# EAGLE design T03_Schematic (EAGLE 7.1.0)
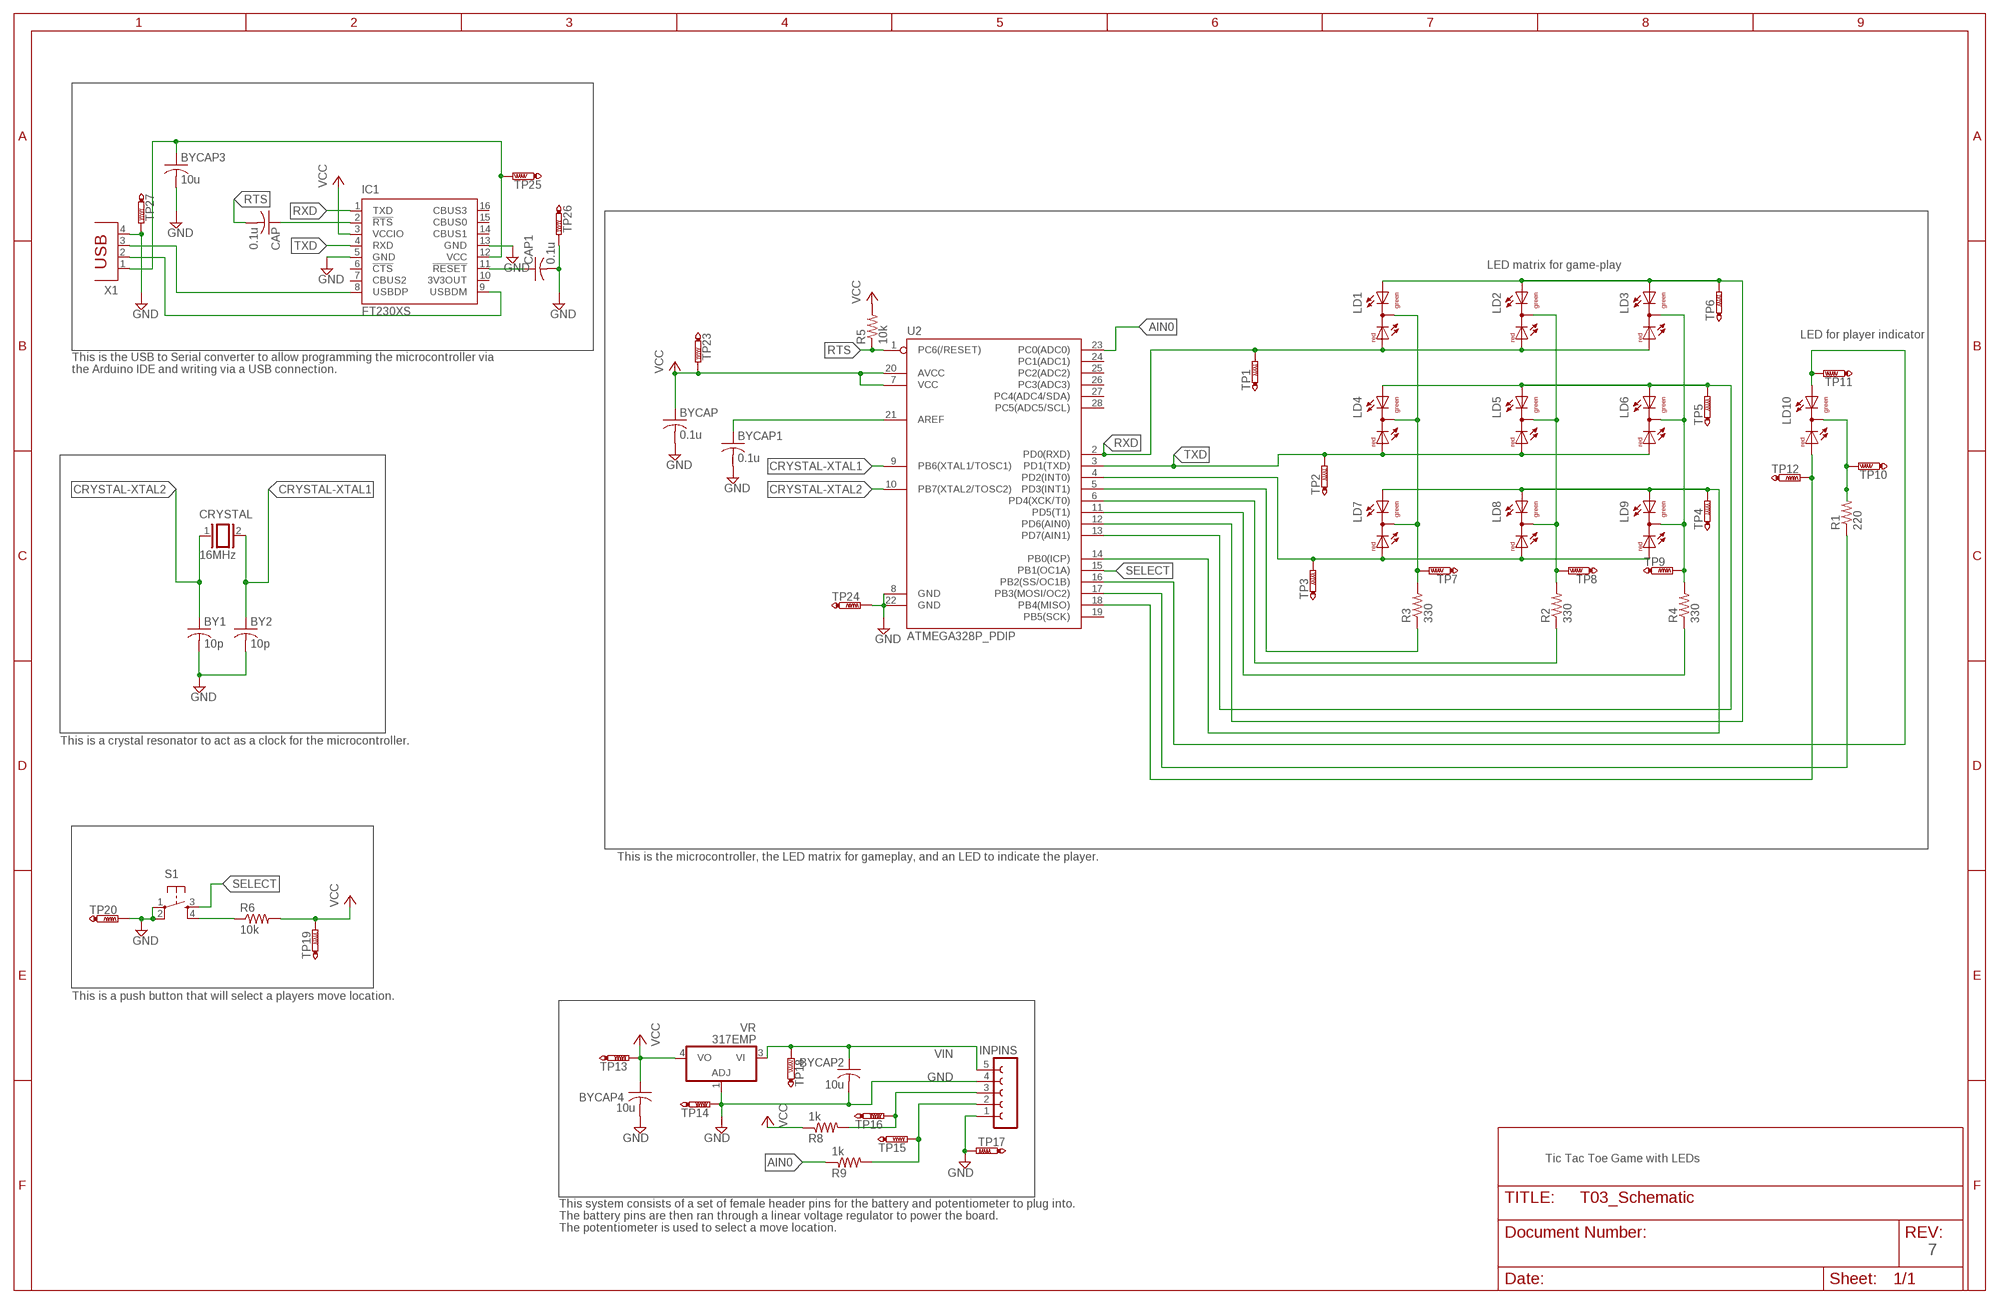
[diagram p0: schematic, sheet 1]

## Parts
BY1  10p  C-USC0805  [C0805]
BY2  10p  C-USC0805  [C0805]
BYCAP  0.1u  C-USC0805  [C0805]
BYCAP1  0.1u  C-USC0805  [C0805]
BYCAP2  10u  C-USC0805  [C0805]
BYCAP3  10u  C-USC0805  [C0805]
BYCAP4  10u  C-USC0805  [C0805]
CAP  0.1u  C-USC0805  [C0805]
CAP1  0.1u  C-USC0805  [C0805]
CRYSTAL  16MHz  XTAL/S  [QS]
IC1  FT230XS  [SSOP16]
INPINS  FE05-1  [FE05-1]
LD1  DUOLED-RG-C  [DUOLED-C-5MM]
LD2  DUOLED-RG-C  [DUOLED-C-5MM]
LD3  DUOLED-RG-C  [DUOLED-C-5MM]
LD4  DUOLED-RG-C  [DUOLED-C-5MM]
LD5  DUOLED-RG-C  [DUOLED-C-5MM]
LD6  DUOLED-RG-C  [DUOLED-C-5MM]
LD7  DUOLED-RG-C  [DUOLED-C-5MM]
LD8  DUOLED-RG-C  [DUOLED-C-5MM]
LD9  DUOLED-RG-C  [DUOLED-C-5MM]
LD10  DUOLED-RG-C  [DUOLED-C-5MM]
R1  220  R-US_M0805  [M0805]
R2  330  R-US_M0805  [M0805]
R3  330  R-US_M0805  [M0805]
R4  330  R-US_M0805  [M0805]
R5  10k  R-US_M0805  [M0805]
R6  10k  R-US_M0805  [M0805]
R8  1k  R-US_M0805  [M0805]
R9  1k  R-US_M0805  [M0805]
S1  DTS-6  [DTS-6]
TP1  PTR1B1,27  [B1,27]
TP2  PTR1B1,27  [B1,27]
TP3  PTR1B1,27  [B1,27]
TP4  PTR1B1,27  [B1,27]
TP5  PTR1B1,27  [B1,27]
TP6  PTR1B1,27  [B1,27]
TP7  PTR1B1,27  [B1,27]
TP8  PTR1B1,27  [B1,27]
TP9  PTR1B1,27  [B1,27]
TP10  PTR1B1,27  [B1,27]
TP11  PTR1B1,27  [B1,27]
TP12  PTR1B1,27  [B1,27]
TP13  PTR1B1,27  [B1,27]
TP14  PTR1B1,27  [B1,27]
TP15  PTR1B1,27  [B1,27]
TP16  PTR1B1,27  [B1,27]
TP17  PTR1B1,27  [B1,27]
TP18  PTR1B1,27  [B1,27]
TP19  PTR1B1,27  [B1,27]
TP20  PTR1B1,27  [B1,27]
TP23  PTR1B1,27  [B1,27]
TP24  PTR1B1,27  [B1,27]
TP25  PTR1B1,27  [B1,27]
TP26  PTR1B1,27  [B1,27]
TP27  PTR1B1,27  [B1,27]
U2  ATMEGA328P_PDIP  [DIL28-3]
VR  317EMP  [SOT223]
X1  PN61729  [PN61729]

## Nets
AIN0: R9.1 U2.23(PC0(ADC0))
CATH1: R3.1 U2.5(PD3(INT1))
CATH2: R2.1 U2.6(PD4(XCK/T0))
CATH3: R4.1 U2.11(PD5(T1))
CATH4: R1.1 U2.17(PB3(MOSI/OC2))
CRYSTAL-XTAL1: BY2.1 CRYSTAL.2 U2.9(PB6(XTAL1/TOSC1))
CRYSTAL-XTAL2: BY1.1 CRYSTAL.1 U2.10(PB7(XTAL2/TOSC2))
D+: IC1.8(USBDP) X1.3
D-: IC1.9(USBDM) X1.2
GND [power]: BY1.2 BY2.2 BYCAP1.2 BYCAP2.2 BYCAP3.2 BYCAP4.2 BYCAP.2 CAP1.2 IC1.5(GND) IC1.13(GND) INPINS.1 INPINS.4 S1.1 S1.2 TP14.TP TP17.TP TP20.TP TP24.TP TP26.TP TP27.TP U2.8(GND) U2.22(GND) VR.1(ADJ) X1.4
GREN1: LD1.AX(AG) LD2.AX(AG) LD3.AX(AG) TP6.TP U2.12(PD6(AIN0))
GREN2: LD4.AX(AG) LD5.AX(AG) LD6.AX(AG) TP5.TP U2.13(PD7(AIN1))
GREN3: LD7.AX(AG) LD8.AX(AG) LD9.AX(AG) TP4.TP U2.14(PB0(ICP))
N$1: LD1.C LD4.C LD7.C R3.2 TP7.TP
N$2: R6.1 S1.4
N$3: LD2.C LD5.C LD8.C R2.2 TP8.TP
N$4: CAP.1 IC1.2(!RTS)
N$6: LD3.C LD6.C LD9.C R4.2 TP9.TP
N$8: CAP1.1 IC1.11(!RESET)
N$9: BYCAP1.1 U2.21(AREF)
N$10: LD10.C R1.2 TP10.TP
PLAY1: LD10.AX(AG) TP11.TP U2.16(PB2(SS/OC1B))
PLAY2: LD10.AR TP12.TP U2.18(PB4(MISO))
RED3: LD7.AR LD8.AR LD9.AR TP3.TP U2.4(PD2(INT0))
RTS: CAP.2 R5.1 U2.1(PC6(/RESET))
RXD: IC1.1(TXD) LD1.AR LD2.AR LD3.AR TP1.TP U2.2(PD0(RXD))
SELECT: S1.3 U2.15(PB1(OC1A))
SELECTPIN: INPINS.2 R9.2 TP15.TP
TXD: IC1.4(RXD) LD4.AR LD5.AR LD6.AR TP2.TP U2.3(PD1(TXD))
USBVCC [usb]: BYCAP3.1 IC1.12(VCC) TP25.TP X1.1
V+POT: INPINS.3 R8.2 TP16.TP
VCC [power]: BYCAP4.1 BYCAP.1 IC1.3(VCCIO) R5.2 R6.2 R8.1 TP13.TP TP19.TP TP23.TP U2.7(VCC) U2.20(AVCC) VR.4(VO)
VIN [power]: BYCAP2.1 INPINS.5 TP18.TP VR.3(VI)
Unconnected: IC1.6(!CTS) IC1.7(CBUS2) IC1.10(3V3OUT) IC1.14(CBUS1) IC1.15(CBUS0) IC1.16(CBUS3) U2.19(PB5(SCK)) U2.24(PC1(ADC1)) U2.25(PC2(ADC2)) U2.26(PC3(ADC3)) U2.27(PC4(ADC4/SDA)) U2.28(PC5(ADC5/SCL))

## Notes on the sheet
- LED matrix for game-play
- LED for player indicator
- This is the USB to Serial converter to allow programming the microcontroller via 
  the Arduino IDE and writing via a USB connection.
- This is a crystal resonator to act as a clock for the microcontroller.
- This is the microcontroller, the LED matrix for gameplay, and an LED to indicate the player.
- This is a push button that will select a players move location.
- Tic Tac Toe Game with LEDs
- This system consists of a set of female header pins for the battery and potentiometer to plug into.
  The battery pins are then ran through a linear voltage regulator to power the board.
  The potentiometer is used to select a move location.
- 7

## Library data of the parts
BY1 BY2 BYCAP BYCAP1-BYCAP4 CAP CAP1 = adafruit:C-US: CAPACITOR, American symbol
CRYSTAL = special:XTAL/S: CRYSTAL
IC1 = ftdichip:FT230X: USB to BASIC UART IC Auto generated by make-symbol-device-package-bsdl.ulp Rev. 43 Source: Data sheet <http://www.ftdichip.com/Support/Documents/DataSheets/ICs/DS_FT230X.pdf>
INPINS = con-lsta:FE05-1: FEMALE HEADER; OC_FARNELL: unknown; OC_NEWARK: unknown
LD1-LD10 = led:DUOLED-RG-C: DUO LED 2 colors (red/green), 5 mm, round, common Cathode www.ligitek.com or other producers.
R1-R6 R8 R9 = adafruit:R-US_: RESISTOR, American symbol
S1 = switch-tact:DTS-6
TP1-TP20 TP23-TP27 = testpad:PTR1: TEST PIN
U2 = SparkFun-DigitalIC:ATMEGA328P_PDIP: uC used in the Arduino 32kb flash, 1k EEPROM, 2k SRAM This is the through-hole version of this chip.
VR = linear:*317: Positive VOLTAGE REGULATOR
X1 = con-berg:PN61729: BERG USB connector; OC_FARNELL: unknown; OC_NEWARK: unknown

## Net classes
0 default: width 0.203 mm
1 power: width 1.27 mm
2 usb: width 0.635 mm

## Board
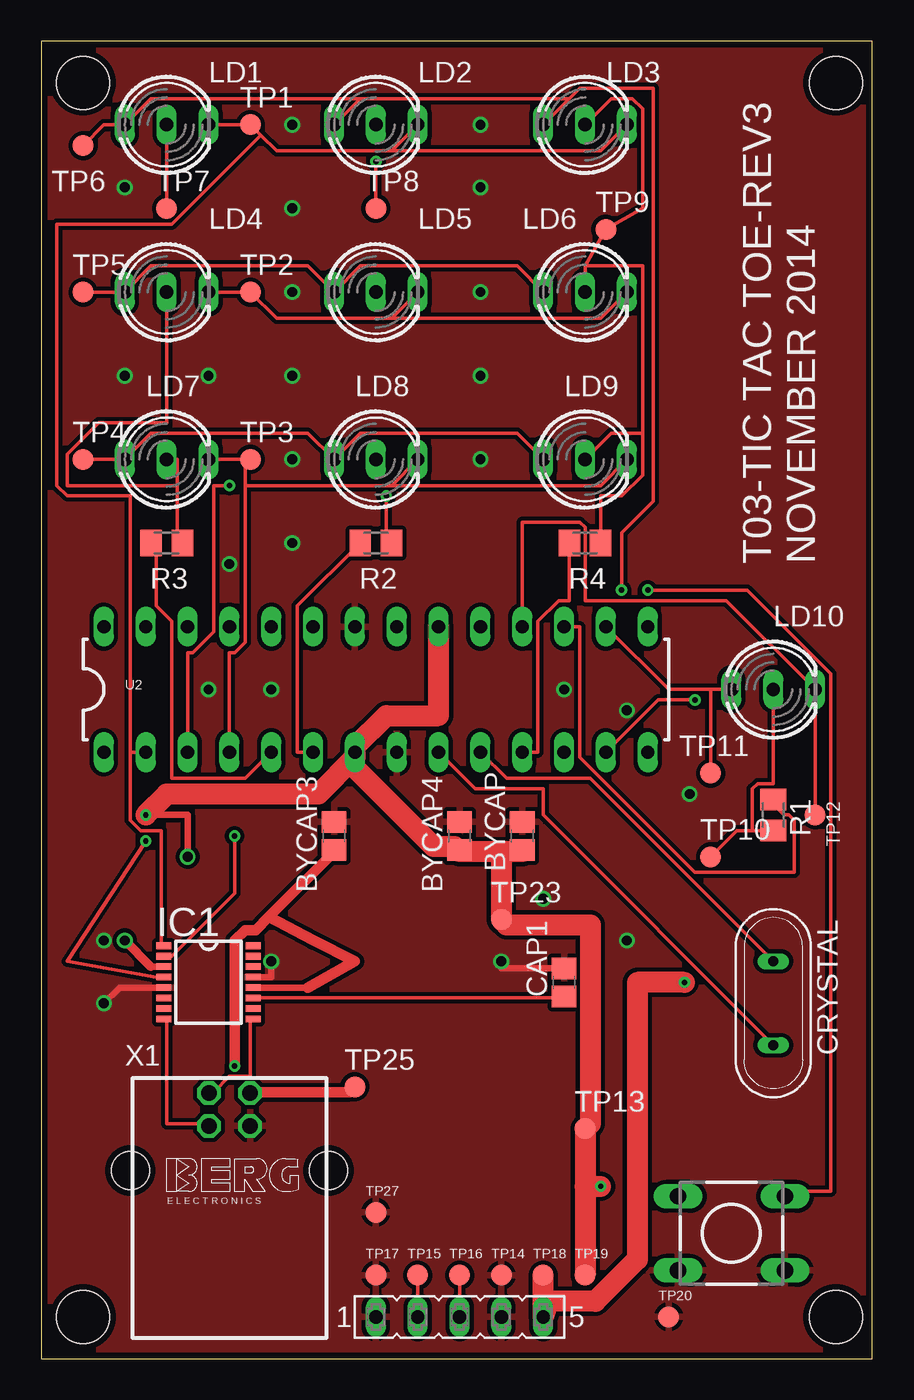
[diagram p1: board, top side]
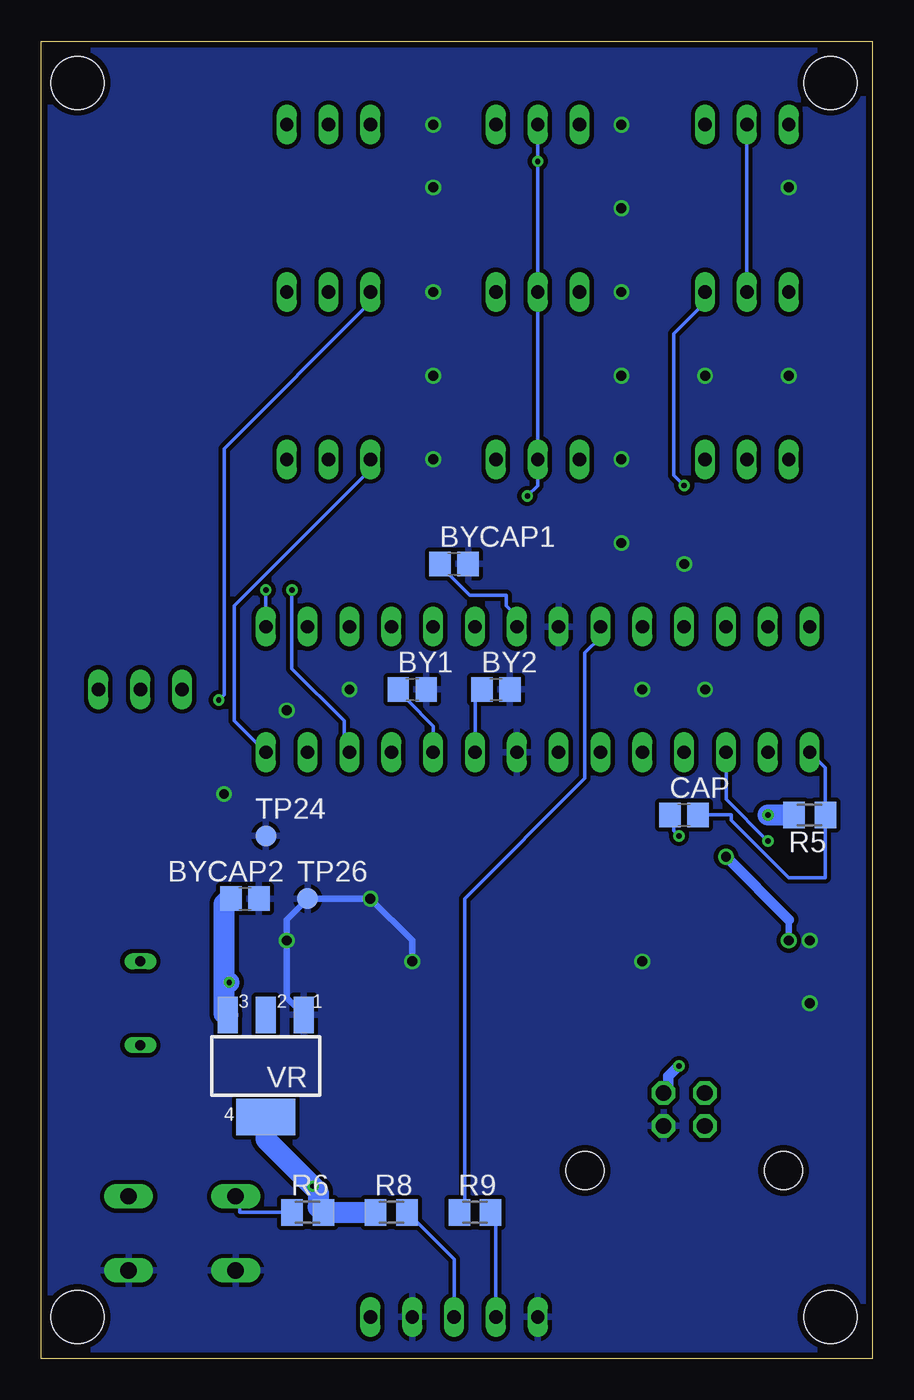
[diagram p2: board, bottom side, seen from below]

Size 50.47 x 80 mm. Coordinates in mm from the lower left corner, seen from the top.
Outline: 0,0 50.47,0 50.47,80 0,80 0,0
Copper layers (1*16): Top 0.0356mm / dielectric 1.5011mm / Bottom 0.0356mm
Design rules "OSH-Park-2-layer": minimum track width 6mil, minimum drill 13mil, track to track 6mil, track to pad 6mil, pad to pad 6mil, via to via 6mil, smd to smd 6mil, copper to edge 15mil, drill to drill 6mil, minimum pad ring 7mil, minimum via ring 7mil, stop-mask expansion 3mil, vias tented up to drill 0mil, thermal gap 10mil
Holes 3.2 mm at 2.54,2.54 48.26,2.54 48.26,77.47 2.54,77.47

### Footprints (pad centres in the part's own frame; a part is rotated, then mirrored left to right if it is on the bottom)
C0805 = smd 1.3 x 1.5: 1 -0.85,0; 2 0.85,0
QS = drill 0.61 long: 1 -2.54,0; 2 2.54,0
SSOP16 = smd 0.914 x 0.406: 1 -2.718,2.223; 2 -2.718,1.587; 3 -2.718,0.953; 4 -2.718,0.318; 5 -2.718,-0.318; 6 -2.718,-0.953; 7 -2.718,-1.587; 8 -2.718,-2.223; 9 2.718,-2.223; 10 2.718,-1.587; 11 2.718,-0.953; 12 2.718,-0.318; 13 2.718,0.318; 14 2.718,0.953; 15 2.718,1.587; 16 2.718,2.223
FE05-1 = drill 0.813 long: 1 -5.08,0; 2 -2.54,0; 3 0,0; 4 2.54,0; 5 5.08,0
DUOLED-C-5MM = drill 0.813 long: AR 2.54,0; AX -2.54,0; C 0,0
M0805 = smd 1.3 x 1.6: 1 -0.95,0; 2 0.95,0
DTS-6 = drill 1 long: 1 -3.25,2.25; 2 3.25,2.25; 3 -3.25,-2.25; 4 3.25,-2.25
B1,27 = smd 1.27 x 1.27: TP 0,0
DIL28-3 = drill 0.813 long: 1 -16.51,-3.81; 2 -13.97,-3.81; 3 -11.43,-3.81; 4 -8.89,-3.81; 5 -6.35,-3.81; 6 -3.81,-3.81; 7 -1.27,-3.81; 8 1.27,-3.81; 9 3.81,-3.81; 10 6.35,-3.81; 11 8.89,-3.81; 12 11.43,-3.81; 13 13.97,-3.81; 14 16.51,-3.81; 15 16.51,3.81; 16 13.97,3.81; 17 11.43,3.81; 18 8.89,3.81; 19 6.35,3.81; 20 3.81,3.81; 21 1.27,3.81; 22 -1.27,3.81; 23 -3.81,3.81; 24 -6.35,3.81; 25 -8.89,3.81; 26 -11.43,3.81; 27 -13.97,3.81; 28 -16.51,3.81
SOT223 = smd 1.219 x 2.235: 1 -2.311,-3.099; 2 0,-3.099; 3 2.311,-3.099 | smd 3.6 x 2.2: 4 0,3.099
PN61729 = drill 0.95 octagon: 1 1.25,4.71; 2 -1.25,4.71; 3 -1.25,2.71; 4 1.25,2.71 | hole 2.3: -6.02,0; 6.02,0

### Placement (x,y rotation side)
BY1  27.94,40.64 0 bottom
BY2  22.86,40.64 0 bottom
BYCAP  29.21,31.75 90 top
BYCAP1  25.4,48.26 0 bottom
BYCAP2  38.1,27.94 0 bottom
BYCAP3  17.78,31.75 90 top
BYCAP4  25.4,31.75 90 top
CAP  11.43,33.02 0 bottom
CAP1  31.75,22.86 90 top
CRYSTAL  44.45,21.59 270 top
IC1  10.16,22.86 0 top
INPINS  25.4,2.54 0 top
LD1  7.62,74.93 0 top
LD2  20.32,74.93 0 top
LD3  33.02,74.93 0 top
LD4  7.62,64.77 0 top
LD5  20.32,64.77 0 top
LD6  33.02,64.77 0 top
LD7  7.62,54.61 0 top
LD8  20.32,54.61 0 top
LD9  33.02,54.61 0 top
LD10  44.45,40.64 0 top
R1  44.45,33.02 270 top
R2  20.32,49.53 0 top
R3  7.62,49.53 0 top
R4  33.02,49.53 0 top
R5  3.81,33.02 180 bottom
R6  34.29,8.89 0 bottom
R8  29.21,8.89 0 bottom
R9  24.13,8.89 0 bottom
S1  41.91,7.62 180 top
TP1  12.7,74.93 0 top
TP2  12.7,64.77 0 top
TP3  12.7,54.61 0 top
TP4  2.54,54.61 0 top
TP5  2.54,64.77 0 top
TP6  2.54,73.66 0 top
TP7  7.62,69.85 0 top
TP8  20.32,69.85 0 top
TP9  34.29,68.58 0 top
TP10  40.64,30.48 0 top
TP11  40.64,35.56 0 top
TP12  46.99,33.02 0 top
TP13  33.02,13.97 0 top
TP14  27.94,5.08 0 top
TP15  22.86,5.08 0 top
TP16  25.4,5.08 0 top
TP17  20.32,5.08 0 top
TP18  30.48,5.08 0 top
TP19  33.02,5.08 0 top
TP20  38.1,2.54 0 top
TP23  27.94,26.67 0 top
TP24  36.83,31.75 0 bottom
TP25  19.05,16.51 0 top
TP26  34.29,27.94 0 bottom
TP27  20.32,8.89 0 top
U2  20.32,40.64 0 top
VR  36.83,17.78 180 bottom
X1  11.43,11.43 0 top

### Tracks (layer width: path | path; a pad name or v marks a point on that pad's centre or on a via)
AIN0
  Bottom 0.203: U2.23 16.51,43.81 17.46,42.86 17.46,35.24 24.77,27.94 24.77,8.89 R9.1
CATH1
  Top 0.203: U2.5 12.38,35.24 7.94,35.24 7.94,44.77 6.99,45.72 6.99,49.53 R3.1
CATH2
  Top 0.203: U2.6 15.56,36.83 15.56,45.72 R2.1
CATH3
  Top 0.203: U2.11 30.16,36.83 30.16,44.77 31.43,46.04 32.07,46.04 R4.1
CATH4
  Top 0.203: U2.17 32.7,44.45 32.7,36.51 39.69,29.53 45.72,29.53 45.72,32.7 45.4,33.02 45.09,33.02 44.45,33.66 R1.1
CRYSTAL-XTAL1
  Top 0.203: CRYSTAL.2 30.48,33.02 30.48,34.61 26.35,34.61 U2.9
  Bottom 0.203: U2.9 24.13,40.32 23.81,40.64 BY2.1
CRYSTAL-XTAL2
  Top 0.203: CRYSTAL.1 33.34,35.24 28.26,35.24 U2.10
  Bottom 0.203: U2.10 26.67,38.42 28.26,40.01 28.26,40.32 28.57,40.64 BY1.1
D+
  Top 0.203: IC1.8 7.62,20.64 7.62,14.29 10.16,14.29 X1.3
D-
  Top 0.203: IC1.9 12.7,20.64 12.7,17.14 11.43,17.14 10.48,16.19 X1.2
GND  (via drill 0.6)
  Top 0.406: IC1.5 4.76,22.54 v3.81,21.59 | IC1.13 13.97,23.18 v13.97,24.13 | CAP1.2 27.94,23.71 v27.94,24.13
  Bottom 0.406: v27.94,24.13 27.94,25.4 v30.48,27.94 TP26.TP 35.56,26.67 v35.56,25.4 35.56,24.13 35.56,21.92 VR.1
  other vias: 3.81,25.4 39.37,34.29 31.75,40.64 35.56,39.37 13.97,40.64 15.24,49.53 15.24,59.69 26.67,59.69 26.67,54.61 5.08,59.69 10.16,59.69 15.24,69.85 5.08,71.12 26.67,71.12 26.67,64.77 15.24,64.77 26.67,74.93 15.24,74.93 10.16,40.64 11.43,48.26 15.24,54.61
  pour Bottom (isolate 0.254): -1.27,81.28 -1.27,-2.54 53.34,-2.54 53.34,81.28
  pour Top (isolate 0.254): -1.27,81.28 -1.27,-2.54 53.34,-2.54 53.34,81.28
GREN1  (via drill 0.33)
  Top 0.203: TP6.TP 3.81,74.93 LD1.AX 6.67,76.52 19.37,76.52 | v35.24,46.67 35.24,50.16 37.15,52.07 37.15,77.15 32.7,77.15 32.07,76.52 | LD3.AX 32.07,76.52 | 19.37,76.52 LD2.AX | 32.07,76.52 19.37,76.52
  Bottom 0.203: U2.12 32.07,37.15 32.07,38.73 35.24,41.91 v35.24,46.67
GREN2  (via drill 0.33)
  Top 0.203: TP5.TP LD4.AX 6.67,66.36 16.19,66.36 LD5.AX 19.37,66.36 28.89,66.36 LD6.AX | U2.13 37.47,40.01 v39.69,40.01
  Bottom 0.203: v39.69,40.01 39.37,40.32 39.37,55.24 30.48,64.14 LD6.AX
GREN3
  Top 0.203: TP4.TP LD7.AX 6.67,56.2 16.19,56.2 LD8.AX 19.37,56.2 28.89,56.2 LD9.AX
  Bottom 0.203: U2.14 38.73,38.73 38.73,45.72 30.48,53.98 LD9.AX
N$1
  Top 0.203: LD1.C TP7.TP | 8.26,53.02 8.26,54.61 LD7.C | 8.26,53.02 8.26,49.53 R3.2 | LD4.C 7.62,56.83 3.49,56.83 1.59,54.93 1.59,53.02 8.26,53.02
  Bottom 0.203: LD4.C LD1.C
N$2
  Bottom 0.203: R6.1 38.42,8.89 38.42,9.84 S1.4
N$3  (via drill 0.33)
  Top 0.203: v20.95,52.39 20.95,49.53 R2.2 | v20.32,72.71 TP8.TP
  Bottom 0.203: v20.95,52.39 20.32,53.02 LD8.C LD5.C v20.32,72.71 LD2.C
N$4  (via drill 0.33)
  Top 0.203: IC1.2 7.94,24.45 11.75,28.26 v11.75,31.75
  Bottom 0.203: v11.75,31.75 12.06,32.07 12.06,33.02 CAP.1
N$6
  Top 0.203: 36.51,56.2 36.51,53.66 35.24,52.39 33.97,52.39 R4.2 | 36.51,56.2 34.61,56.2 LD9.C | LD6.C 33.02,66.36 | 33.02,66.36 TP9.TP 36.51,69.85 36.51,75.88 35.88,76.52 34.61,76.52 LD3.C | 36.51,56.2 36.51,66.36 33.02,66.36
N$8
  Top 0.203: IC1.11 31.75,21.91 CAP1.1
N$9
  Bottom 0.203: U2.21 21.59,45.09 22.23,45.72 22.23,46.35 24.45,46.35 25.72,47.62 25.72,47.94 26.04,48.26 BYCAP1.1
N$10
  Top 0.203: TP10.TP 42.23,32.07 43.18,32.07 | 43.18,32.07 R1.2 | LD10.C 44.45,34.92 43.5,34.92 43.18,34.61 43.18,32.07
PLAY1
  Top 0.203: 40.64,40.64 TP11.TP | LD10.AX 40.64,40.64 | U2.16 38.1,40.64 40.64,40.64
PLAY2
  Top 0.203: TP12.TP LD10.AR 41.59,46.04 33.02,46.04 33.02,50.48 32.7,50.8 29.21,50.8 U2.18
RED3
  Top 0.203: LD7.AR 12.38,54.61 | U2.4 11.43,42.86 11.75,42.86 12.38,43.5 12.38,53.02 | 12.38,54.61 12.38,53.02 | 12.38,54.61 TP3.TP | 21.27,53.02 LD8.AR | 12.38,53.02 21.27,53.02 | LD9.AR 33.97,53.02 21.27,53.02
RTS
  Bottom 0.203: CAP.2 8.57,33.02 8.57,32.7 5.08,29.21 2.86,29.21 R5.1 | U2.1 2.86,35.88 R5.1 | R5.1
RXD
  Top 0.203: 5.4,36.83 5.4,32.7 6.03,32.07 7.3,32.07 7.3,25.08 IC1.1 | U2.2 5.4,36.83 | LD1.AR TP1.TP 13.34,74.3 | 21.27,73.34 LD2.AR | 21.27,73.34 14.29,73.34 13.34,74.3 | LD3.AR 33.97,73.34 21.27,73.34 | 5.4,36.83 5.4,52.39 1.59,52.39 0.95,53.02 0.95,68.9 7.94,68.9 13.34,74.3
SELECT  (via drill 0.33)
  Top 0.203: v36.83,46.67 42.86,46.67 47.94,41.59 47.94,10.16 45.4,10.16 S1.3
  Bottom 0.203: v36.83,46.67 U2.15
SELECTPIN
  Top 0.203: INPINS.2 TP15.TP
  Bottom 0.203: INPINS.2 22.86,8.57 R9.2
TXD  (via drill 0.33)
  Top 0.203: IC1.4 6.99,23.18 1.59,24.13 v6.35,31.43 | LD4.AR TP2.TP 14.29,63.18 21.27,63.18 | 21.27,63.18 LD5.AR | LD6.AR 33.97,63.18 21.27,63.18 | U2.3 8.89,42.86 9.21,42.86 10.48,44.13 10.48,53.02 v11.43,53.02
  Bottom 0.203: v6.35,31.43 8.89,33.97 U2.3 | v11.43,53.02 12.06,53.66 12.06,62.23 10.16,64.14 LD4.AR
USBVCC  (via drill 0.33)
  Top 0.406: IC1.12 16.19,22.54
  Top 0.635: TP25.TP 18.73,16.19 12.7,16.19 X1.1 | 13.81,26.83 13.02,26.04 12.38,26.04 11.75,25.4 v11.75,17.78 | 13.81,26.83 17.78,30.8 BYCAP3.1 | 16.19,22.54 19.05,24.13 16.51,25.4 13.81,26.83
  Bottom 0.635: v11.75,17.78 12.38,17.14 12.38,16.19 X1.1
V+POT
  Top 0.203: INPINS.3 TP16.TP
  Bottom 0.203: INPINS.3 25.4,6.03 R8.2
VCC  (via drill 0.33, 0.6)
  Top 0.406: v6.35,33.02 8.89,33.02 v8.89,30.48 | 6.67,23.81 IC1.3
  Top 0.508: v5.08,25.4 6.67,23.81
  Top 1.27: 33.02,10.48 TP13.TP 33.34,14.29 33.34,26.35 28.26,26.35 TP23.TP 27.94,30.8 | 33.02,10.48 TP19.TP | 27.94,30.8 29.21,30.8 BYCAP.1 | 27.94,30.8 25.4,30.8 BYCAP4.1 25.08,31.11 23.81,31.11 19.05,35.88 U2.7 | v6.35,33.02 7.62,34.29 16.83,34.29 19.05,36.51 U2.7 | U2.20 24.13,39.05 20.95,39.05 19.05,37.15 U2.7 | 33.02,10.48 v33.97,10.48
  Bottom 0.406: 5.08,26.67 v5.08,25.4
  Bottom 0.635: v8.89,30.48 5.08,26.67
  Bottom 1.27: R8.1 R6.2 33.66,9.21 33.66,10.16 v33.97,10.48 36.83,13.34 VR.4 | v6.35,33.02 R5.2
VIN  (via drill 0.33)
  Top 1.27: TP18.TP INPINS.5 30.8,3.49 33.66,3.49 36.2,6.03 36.2,22.86 v39.05,22.86
  Bottom 1.27: 39.37,22.86 39.37,20.95 VR.3 | 39.37,22.86 39.37,27.62 39.05,27.94 BYCAP2.1 | v39.05,22.86 39.37,22.86

### Text on the board
tPlace: T03-TIC TAC TOE-REV3 / NOVEMBER 2014